# Altium schematic sheet Power.SchDoc
size A
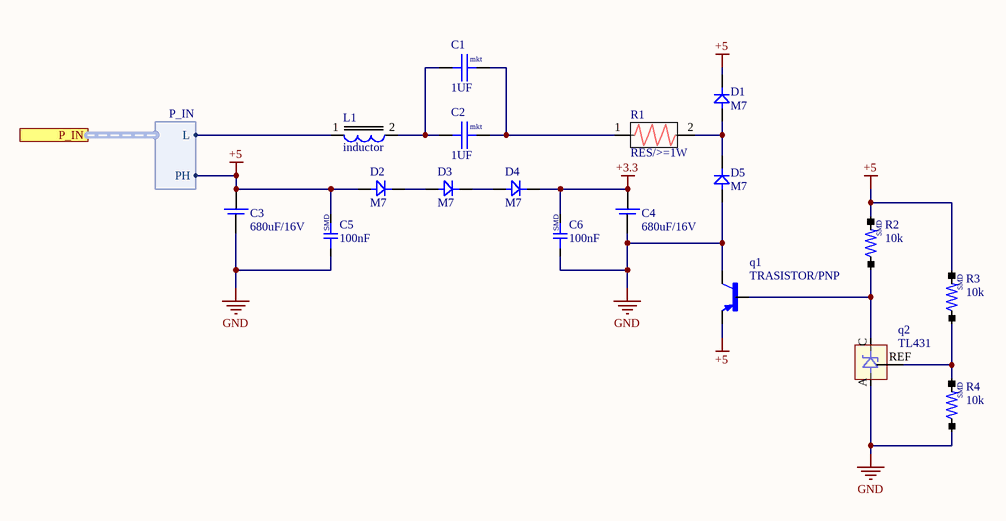
[diagram p0: Power.SchDoc]

## Parts
C1  1UF  [CAP/0.22uF/275v/mkt]
C2  1UF  [CAP/0.22uF/275v/mkt]
C3  680uF/16V  [cap/330u/16v]
C4  680uF/16V  [cap/330u/16v]
C5  100nF  [CAP-0805]
C6  100nF  [CAP-0805]
D1  M7  [DIOD/1N4007/SMD]
D2  M7  [DIOD/1N4007/SMD]
D3  M7  [DIOD/1N4007/SMD]
D4  M7  [DIOD/1N4007/SMD]
D5  M7  [DIOD/1N4007/SMD]
L1  inductor  [inductor-9*12]
q1  TRASISTOR/PNP  [BC557]
q2  TL431  [TL431]
R1  RES/>=1W  [RES/1W]
R2  10k  [RES/0805]
R3  10k  [RES/0805]
R4  10k  [RES/0805]

## Ports
P_IN (harness P_IN)

## Harnesses
P_IN: L, PH

## Nets
+3.3: C4.+ C6.2 D4.K
+5: C3.+ C5.2 D1.K D2.A q1.E R2.2 R3.2 ; port P_IN.PH
GND: C3.- C4.- C5.1 C6.1 D5.A q1.C q2.A R4.1
NetC1_1: C1.1 C2.1 L1.2
NetC1_2: C1.2 C2.2 R1.1
NetD1_A: D1.A D5.K R1.2
NetD2_K: D2.K D3.A
NetD3_K: D3.K D4.A
NetL1_1: L1.1 ; port P_IN.L
Netq1_B: q1.B q2.C R2.1
Netq2_REF: q2.REF R3.1 R4.2

## Notes on the sheet
- (in symbol cap-mkt) mkt
- (in symbol cap_smd) SMD
- (in symbol RES/SMD) SMD

## Library data of the parts
C1 C2 = cap-mkt
C3 C4 = cap-electrolit
C5 C6 = cap_smd
D1-D5 = DIOD/RECTIFIERS
R2-R4 = RES/SMD